# Altium schematic sheet BLDC_Schem.SchDoc
size A4; SheetNumber: 1; SheetTotal: 6
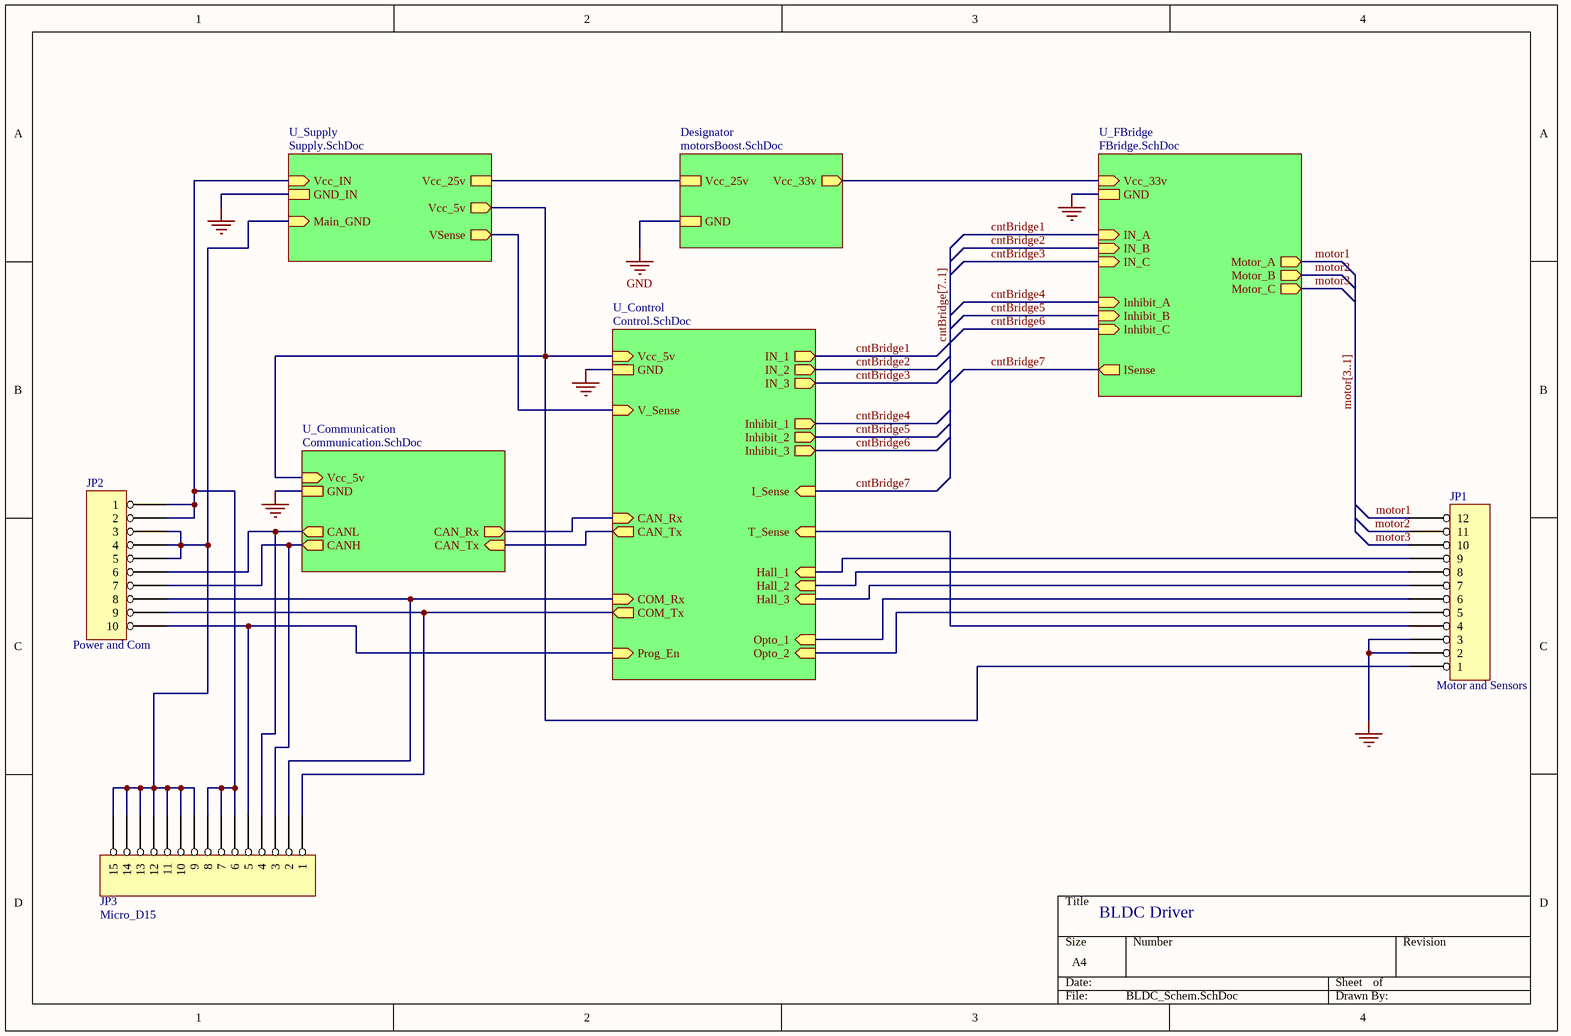
[diagram p0: BLDC_Schem.SchDoc]

## Parts
JP1  Motor and Sensors  [HDR1X12]
JP2  Power and Com  [HDR1X10]
JP3  Micro_D15  [Micro_D]

## Sub-sheets
Designator = motorsBoost.SchDoc: Vcc_25v, GND, Vcc_33v (out)
U_Communication = Communication.SchDoc: GND, Vcc_5v (in), CANL (out), CANH (out), CAN_Tx (in), CAN_Rx (out)
U_Control = Control.SchDoc: GND, I_Sense (in), Hall_2 (in), V_Sense (in), Hall_1 (in), Hall_3 (in), COM_Rx (in), COM_Tx (out), IN_1 (out), IN_2 (out), IN_3 (out), Inhibit_3 (out), Inhibit_2 (out), Inhibit_1 (out), Vcc_5v (in), Opto_1 (in), Opto_2 (in), CAN_Rx (in), CAN_Tx (out), T_Sense (in), Prog_En (in)
U_FBridge = FBridge.SchDoc: IN_A (in), Inhibit_A (in), Vcc_33v (in), GND, ISense (out), Motor_A (out), IN_B (in), Inhibit_B (in), Motor_B (out), IN_C (in), Inhibit_C (in), Motor_C (out)
U_Supply = Supply.SchDoc: Vcc_IN (in), GND_IN, Vcc_25v, Vcc_5v (out), VSense (out), Main_GND (in)

## Nets
GND: JP1.2 JP1.3 ; sheet U_Communication/GND, sheet U_Control/GND, sheet U_FBridge/GND, sheet U_Supply/GND_IN, sheet Designator/GND
cntBridge1: sheet U_Control/IN_1, sheet U_FBridge/IN_A
cntBridge2: sheet U_Control/IN_2, sheet U_FBridge/IN_B
cntBridge3: sheet U_Control/IN_3, sheet U_FBridge/IN_C
cntBridge4: sheet U_Control/Inhibit_1, sheet U_FBridge/Inhibit_A
cntBridge5: sheet U_Control/Inhibit_2, sheet U_FBridge/Inhibit_B
cntBridge6: sheet U_Control/Inhibit_3, sheet U_FBridge/Inhibit_C
cntBridge7: sheet U_Control/I_Sense, sheet U_FBridge/ISense
motor1: JP1.12 ; sheet U_FBridge/Motor_A
motor2: JP1.11 ; sheet U_FBridge/Motor_B
motor3: JP1.10 ; sheet U_FBridge/Motor_C
NetJP1_1: JP1.1 ; sheet U_Communication/Vcc_5v, sheet U_Control/Vcc_5v, sheet U_Supply/Vcc_5v
NetJP1_4: JP1.4 ; sheet U_Control/T_Sense
NetJP1_5: JP1.5 ; sheet U_Control/Opto_2
NetJP1_6: JP1.6 ; sheet U_Control/Opto_1
NetJP1_7: JP1.7 ; sheet U_Control/Hall_3
NetJP1_8: JP1.8 ; sheet U_Control/Hall_2
NetJP1_9: JP1.9 ; sheet U_Control/Hall_1
NetJP2_1: JP2.1 JP2.2 JP3.6 JP3.7 JP3.8 ; sheet U_Supply/Vcc_IN
NetJP2_3: JP2.3 JP2.4 JP2.5 JP3.9 JP3.10 JP3.11 JP3.12 JP3.13 JP3.14 JP3.15 ; sheet U_Supply/Main_GND
NetJP2_6: JP2.6 JP3.4 ; sheet U_Communication/CANL
NetJP2_7: JP2.7 JP3.3 ; sheet U_Communication/CANH
NetJP2_8: JP2.8 JP3.2 ; sheet U_Control/COM_Rx
NetJP2_9: JP2.9 JP3.1 ; sheet U_Control/COM_Tx
NetJP2_10: JP2.10 JP3.5 ; sheet U_Control/Prog_En
(unnamed): sheet U_Communication/CAN_Tx, sheet U_Control/CAN_Tx
(unnamed): sheet U_Communication/CAN_Rx, sheet U_Control/CAN_Rx
(unnamed): sheet U_Control/V_Sense, sheet U_Supply/VSense
(unnamed): sheet U_FBridge/Vcc_33v, sheet Designator/Vcc_33v
(unnamed): sheet U_Supply/Vcc_25v, sheet Designator/Vcc_25v

## Buses and harness runs
bus cntBridge[7..1]
bus motor[3..1]

## Notes on the sheet
- BLDC Driver

## Library data of the parts
JP1 = HEADER 12
JP2 = HEADER 10
JP3 = HEADER 15